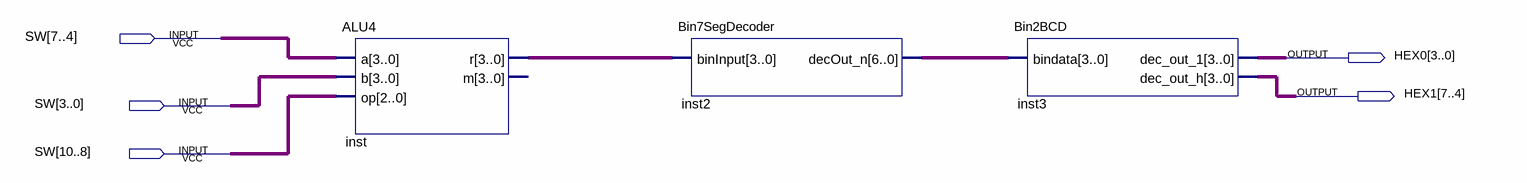
[diagram p0: schematic sheet]
// Quartus schematic ALUDemo.bdf as structural Verilog: 3 symbols, 5 pins
module ALUDemo (
  input  [10:0] SW,
  output [3:0] HEX0,
  output [7:4] HEX1
);

  wire [3:0] inst_r;
  wire [6:0] inst2_decout_n;

  ALU4 inst (.a(SW[7:4]), .b(SW[3:0]), .op(SW[10:8]), .r(inst_r));  // open: m
  Bin7SegDecoder inst2 (.binInput(inst_r), .decOut_n(inst2_decout_n));
  Bin2BCD inst3 (.bindata(inst2_decout_n), .dec_out_1(HEX0), .dec_out_h(HEX1));
endmodule
